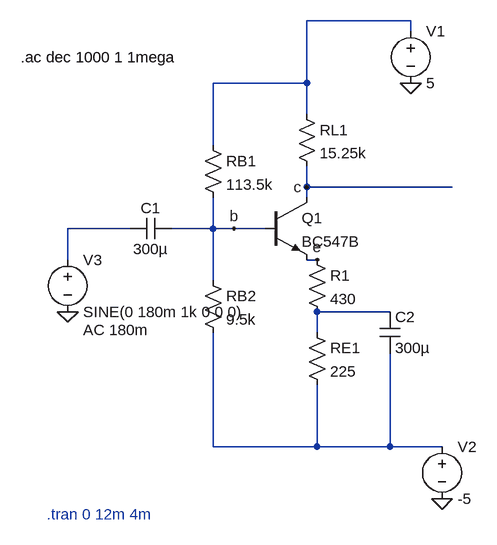
[diagram p0: schematic CE Amplifier Simulation.asc]
CE Amplifier Simulation.asc, the LTspice schematic file:
Version 4.1
SHEET 1 880 680
WIRE 352 -96 192 -96
WIRE 352 -80 352 -96
WIRE 192 0 192 -96
WIRE 192 0 48 0
WIRE 192 48 192 0
WIRE 48 96 48 0
WIRE 192 160 192 128
WIRE 416 160 192 160
WIRE 192 176 192 160
WIRE -80 224 -176 224
WIRE 48 224 48 176
WIRE 48 224 -16 224
WIRE 80 224 48 224
WIRE 128 224 80 224
WIRE -176 272 -176 224
WIRE 208 272 192 272
WIRE 48 304 48 224
WIRE 320 352 208 352
WIRE 208 384 208 352
WIRE 48 560 48 384
WIRE 208 560 208 464
WIRE 208 560 48 560
WIRE 320 560 320 416
WIRE 320 560 208 560
WIRE 400 560 320 560
FLAG 352 0 0
FLAG 400 640 0
FLAG 80 224 b
FLAG 208 272 e
FLAG 192 160 c
FLAG -176 352 0
SYMBOL cap -16 208 R90
WINDOW 0 0 32 VBottom 2
WINDOW 3 32 32 VTop 2
SYMATTR InstName C1
SYMATTR Value 300µ
SYMBOL res 32 80 R0
SYMATTR InstName RB1
SYMATTR Value 113.5k
SYMBOL res 32 288 R0
SYMATTR InstName RB2
SYMATTR Value 9.5k
SYMBOL npn 128 176 R0
SYMATTR InstName Q1
SYMATTR Value BC547B
SYMBOL res 176 32 R0
SYMATTR InstName RL1
SYMATTR Value 15.25k
SYMBOL voltage 352 -96 R0
WINDOW 123 0 0 Left 0
WINDOW 39 0 0 Left 0
SYMATTR InstName V1
SYMATTR Value 5
SYMBOL cap 304 352 R0
SYMATTR InstName C2
SYMATTR Value 300µ
SYMBOL voltage 400 544 R0
WINDOW 123 0 0 Left 0
WINDOW 39 0 0 Left 0
SYMATTR InstName V2
SYMATTR Value -5
SYMBOL res 192 368 R0
SYMATTR InstName RE1
SYMATTR Value 225
SYMBOL res 192 256 R0
SYMATTR InstName R1
SYMATTR Value 430
SYMBOL voltage -176 256 R0
WINDOW 123 24 124 Left 2
WINDOW 39 0 0 Left 0
SYMATTR Value2 AC 180m
SYMATTR InstName V3
SYMATTR Value SINE(0 180m 1k 0 0 0)
TEXT -208 664 Left 2 ;.tran 0 12m 4m
TEXT -248 -40 Left 2 !.ac dec 1000 1 1mega

The netlist it stands for:
* CE Amplifier Simulation.asc
C1 b N002 300µ
RB1 N001 b 113.5k
RB2 b N004 9.5k
Q1 c b e 0 BC547B
RL1 N001 c 15.25k
V1 N001 0 5
C2 N003 N004 300µ
V2 N004 0 -5
RE1 N003 N004 225
R1 e N003 430
V3 N002 0 SINE(0 180m 1k 0 0 0) AC 180m
.model NPN NPN
.model PNP PNP
.lib standard.bjt
* .tran 0 12m 4m
.ac dec 1000 1 1mega
.backanno
.end